# Altium project Solar_PowerBoard.PrjPcb
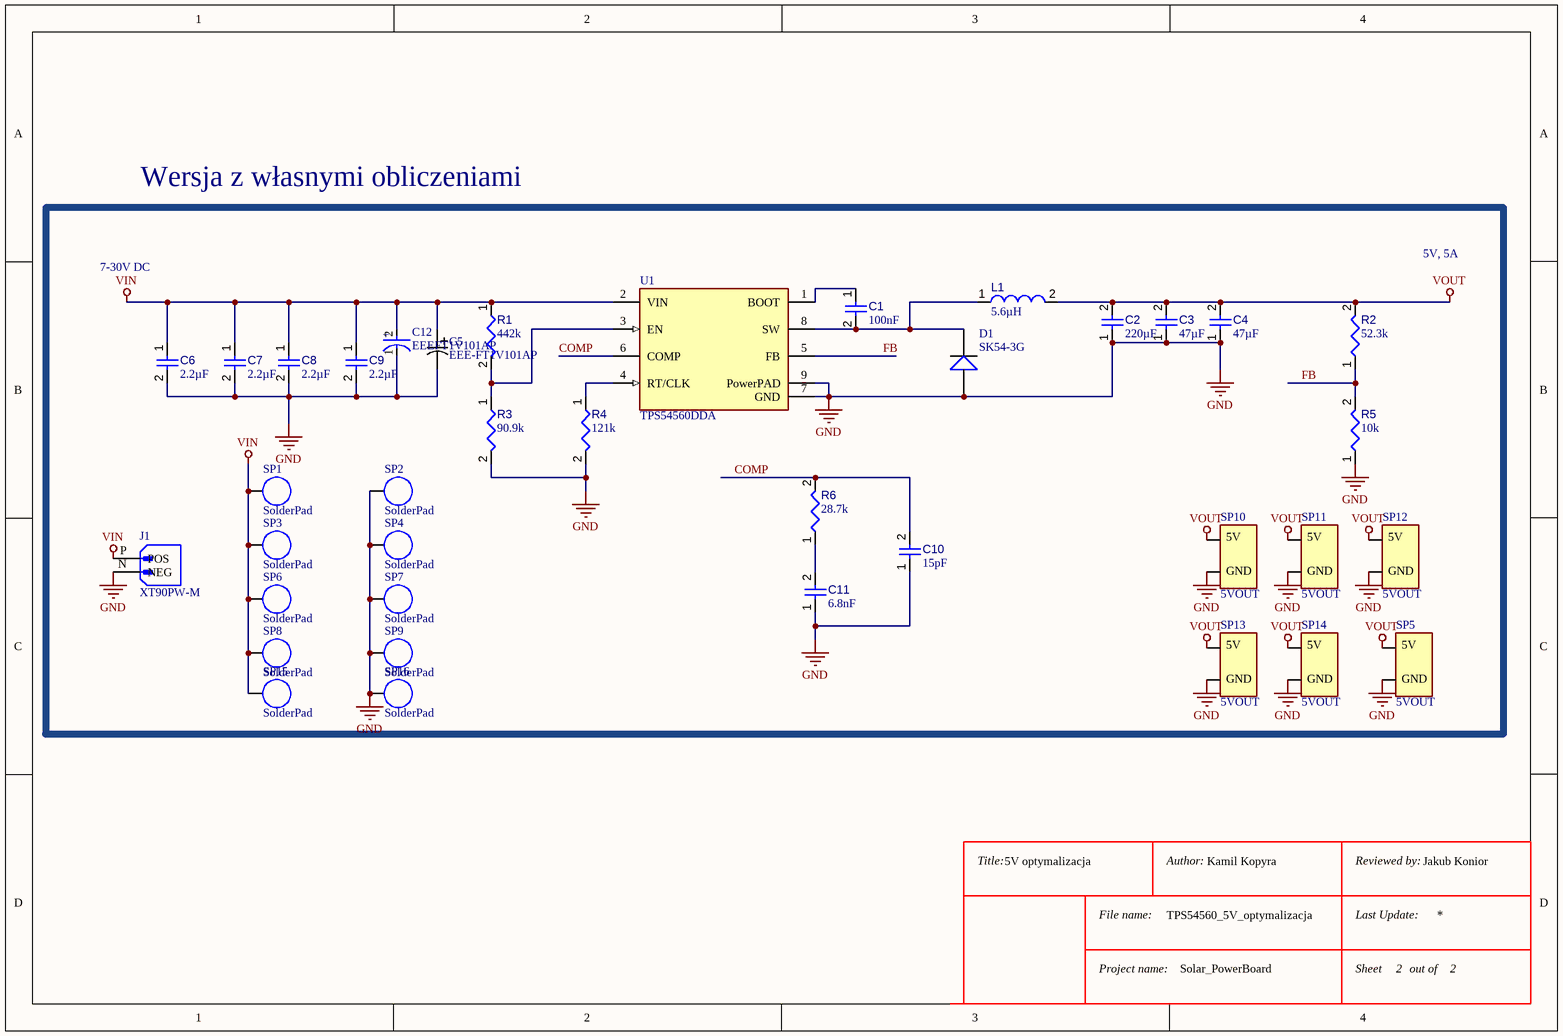
[diagram p0: TPS54560_5V_optymalizacja.SchDoc]
CAGE_CODE: ?????; CONTRACT_NUMBER: <CONTRACT NO>; DOC_NO_ASSY_DWG: <ASSY DWG NO>; DOC_NO_BOM: <BOM DOC NO>; DOC_NO_FAB_DWG: <FAB DWG NO>; DOC_NO_SCH_DWG: <SCH DWG NO>; PCB_2_DEC_TOL: +/-.01; PCB_3_DEC_TOL: +/-.010; PCB_ANG_TOL: +/-1/2; PCB_ASSEMBLY_NO: <PCB ASSY NO>; PCB_CHECKER: - -----; PCB_CHECKER_APP_DATE: --/--/----; PCB_DESIGNER: - -----; PCB_DESIGNER_APP_DATE: --/--/----; PCB_DWG_NO: <PCB DWG NO>; PCB_ENGINEER: - -----; PCB_ENGINEER_APP_DATE: --/--/----; PCB_PART_NUMBER: <PCB PN>; PCB_REV: A; SCH_REV: A
2 sheets, 38 parts. Net scope: global (net labels, ports and power ports of the same name join across sheets).
Board files: Solar_PowerBoard_JK.PcbDoc, Solar_PowerBoard_KK.PcbDoc, Panel.PcbDoc
Sheets:
  Main.SchDoc
  TPS54560_5V_optymalizacja.SchDoc

## Sheet Main.SchDoc
size A4; SheetNumber: 1; SheetTotal: 4; ENG_APP_DATE: --/--/--; DSN_APP_DATE: --/--/--; CHK_APP_DATE: --/--/--

### Notes on the sheet
- Title:
- File name:
- Author:
- Reviewed by:
- Last Update:
- Project name:
- Sheet
- out of

## Sheet TPS54560_5V_optymalizacja.SchDoc
size A4; SheetNumber: 2; SheetTotal: 2

### Parts
C1  value 100nF  [CAPC0805(2012)145_L]  (hidden comment: Capacitor 100nF +/-40% 6.3V 0805)
C2  value 220µF  [CAPC3216X180X50NL20T25]  (hidden comment: Capacitor 220 uF +/- 10% 16 V 1206)
C3  value 47µF  [CAPC0805(2012)145_L]  (hidden comment: Capacitor 47µF +/-40% 6.3V 0805)
C4  value 47µF  [CAPC0805(2012)145_L]  (hidden comment: Capacitor 47µF +/-40% 6.3V 0805)
C5  EEE-FT1V101AP  [CapBulk]
C6  value 2.2µF  [CAPC0805(2012)145_L]  (hidden comment: Capacitor 2.2µF +/-40% 35V 0805)
C7  value 2.2µF  [CAPC0805(2012)145_L]  (hidden comment: Capacitor 2.2µF +/-40% 35V 0805)
C8  value 2.2µF  [CAPC0805(2012)145_L]  (hidden comment: Capacitor 2.2µF +/-40% 35V 0805)
C9  value 2.2µF  [CAPC0805(2012)145_L]  (hidden comment: Capacitor 2.2µF +/-40% 35V 0805)
C10  value 15pF  [CAPC0402(1005)60_L]  (hidden comment: Capacitor 15pF +/-20% 10V 0402)
C11  value 6.8nF  [CAPC0402(1005)60_L]  (hidden comment: Capacitor 15pF +/-20% 10V 0402)
C12  EEEFT1V101AP  [FP-FTD-MFG]
D1  SK54-3G  [SK54-3G]
J1  XT90PW-M  [AMASS_XT90PW-M]
L1  value 5.6µH  [SUSUMU-PCMB063T_V]  (hidden comment: Inductor 5.6uH)
R1  value 442k  [RESC0805(2012)_L]  (hidden comment: Resistor 442kR +/-5% 0805 125 mW)
R2  value 52.3k  [RESC1005X40X25ML05T05]  (hidden comment: Resistor 52.3k +/-1% 0402 100 mW)
R3  value 90.9k  [RESC0805(2012)_L]  (hidden comment: Resistor 90.9 kOhms  +/-5 % 0805 125 mW)
R4  value 121k  [RESC0805(2012)_L]  (hidden comment: Resistor 121 kOhms  +/-5 % 0805 125 mW)
R5  value 10k  [RESC1005X40X25ML05T05]  (hidden comment: Resistor 10k +/-1% 0402 100 mW)
R6  value 28.7k  [RESC1005X40X25ML05T05]  (hidden comment: Resistor 28.7k +/-1% 0402 100 mW)
SP1  SolderPad  [SolderPad]
SP2  SolderPad  [SolderPad]
SP3  SolderPad  [SolderPad]
SP4  SolderPad  [SolderPad]
SP5  5VOUT  [5VOUT]
SP6  SolderPad  [SolderPad]
SP7  SolderPad  [SolderPad]
SP8  SolderPad  [SolderPad]
SP9  SolderPad  [SolderPad]
SP10  5VOUT  [5VOUT]
SP11  5VOUT  [5VOUT]
SP12  5VOUT  [5VOUT]
SP13  5VOUT  [5VOUT]
SP14  5VOUT  [5VOUT]
SP15  SolderPad  [SolderPad]
SP16  SolderPad  [SolderPad]
U1  TPS54560DDA  [FP-DDA0008E-MFG]

### Nets
GND: C2.1 C3.1 C4.1 C5.2 C6.2 C7.2 C8.2 C9.2 C10.1 C11.1 C12.1(C) D1.1 J1.N(NEG) R3.2 R4.2 R5.1 SP2.1 SP4.1 SP5.2 SP7.1 SP9.1 SP10.2 SP11.2 SP12.2 SP13.2 SP14.2 SP16.1 U1.7(GND) U1.9(PowerPAD)
VIN: C5.1 C6.1 C7.1 C8.1 C9.1 C12.2(A) J1.P(POS) R1.1 SP1.1 SP3.1 SP6.1 SP8.1 SP15.1 U1.2(VIN)
VOUT: C2.2 C3.2 C4.2 L1.2 R2.2 SP5.1 SP10.1 SP11.1 SP12.1 SP13.1 SP14.1
COMP: C10.2 R6.2 U1.6(COMP)
FB: R2.1 R5.2 U1.5(FB)
NetC1_1: C1.1 U1.1(BOOT)
NetC1_2: C1.2 D1.2 L1.1 U1.8(SW)
NetC11_2: C11.2 R6.1
NetR1_2: R1.2 R3.1 U1.3(EN)
NetR4_1: R4.1 U1.4(RT/CLK)

### Notes on the sheet
- Wersja z własnymi obliczeniami
- 7-30V DC
- 5V, 5A
- 5V optymalizacja
- TPS54560_5V_optymalizacja
- Kamil Kopyra
- Jakub Konior
- Solar_PowerBoard
- Title:
- File name:
- Author:
- Reviewed by:
- Last Update:
- Project name:
- Sheet
- out of
- (in symbol 5VOUT) 5V; GND
- (in symbol CMP-05427-000027-1) +

### Library data of the parts
C1 = CMP-001-00085-1: Chip Capacitor, 100nF +/-40%, 6.3V, 0805, Thickness 1.45 mm; Tolerance: 10%; Case/Package: 0805; Max Operating Temperature: 85°C; Mounting Technology: SMT; Min Operating Temperature: -55°C; Voltage Rating: 6.3V; Pins: 2
C2 = CMP-001-00088-1: Chip Capacitor, 220 uF, +/- 10%, 16 V, 1206 (3216 Metric); Capacitor Type: Ceramic; Voltage Rating: 16V; RoHS Compliant: True; Mounting Technology: SM; Tolerance: 10%; Max Operating Temperature: 125°C; Case/Package: 1206; Pins: 2; Min Operating Temperature: -55°C
C3 C4 = CMP-001-00082-4: Chip Capacitor, 47µF +/-40%, 6.3V, 0805, Thickness 1.45 mm; Tolerance: 10%; Min Operating Temperature: -55°C; Max Operating Temperature: 85°C; Case/Package: 0805; Pins: 2; Mounting Technology: SMT; Voltage Rating: 6.3V
C5 = EEE-FT1V101AP: Description; Manufacturer_Name: Panasonic; Copyright: Copyright (C) 2025 Ultra Librarian. All rights reserved.; Manufacturer_Part_Number: EEE-FT1V101AP
C6-C9 = CMP-001-00089-1: Chip Capacitor, 2.2µF +/-40%, 35V, 0805, Thickness 1.45 mm; Tolerance: 20%; Pins: 2; Max Operating Temperature: 85°C; Mounting Technology: SMT; Voltage Rating: 35V; Min Operating Temperature: -55°C; Case/Package: 0805
C10 C11 = CMP-001-00087-1: Chip Capacitor, 15pF +/-20%, 10V, 0402, Thickness 0.6 mm; Tolerance: 20%; Voltage Rating: 10V; Min Operating Temperature: -55°C; Mounting Technology: SMT; Pins: 2; Max Operating Temperature: 85°C; Case/Package: 0402
C12 = CMP-05427-000027-1: CAP ALUM 100UF 20% 35V SMD; Ripple Current: 300mA; Polarity: Polar; Life (Hours): 2000Hour; Lead Diameter: 0.65mm; ESR (Equivalent Series Resistance): 260mR; Leakage Current: 35uA; REACH SVHC: No SVHC; Series: FT; Min Operating Temperature: -55°C; Diameter: 6.3mm; Max Operating Temperature: 105°C; Number of Pins: 2; Package Quantity: 1000; Length: 5.8mm; Lead Pitch: 1.8mm; Voltage: 35V; Construction: Cylindrical; Capacitance: 100uF; Height: 5.8mm; Tolerance: 20%; RoHS Compliant: Yes; Packaging: Tape and Reel; Ripple Current (AC): 300mA; Height - Seated (Max): 0.24inch; Voltage Rating: 35V; Radiation Hardening: No; Contact Plating: Tin; Termination: SMD/SMT; Voltage Rating (DC): 35V; Case/Package: Radial; Mount: Surface Mount
D1 = Diode
J1 = CMP-002-00071-1: Socket; DC supply; XT90; male; PIN: 2; on PCBs; THT; Colour: yellow; MF: AMASS; Check_prices: https://www.snapeda.com/parts/XT90PW-M/AMASS/view-part/?ref=eda; Pins: 2; Case/Package: Package; SnapEDA_Link: https://www.snapeda.com/parts/XT90PW-M/AMASS/view-part/?ref=snap; Design Item ID: XT90PW-M; Component Type: Standard; Source: XT90PW-M.SchLib; Value: *; MP: XT90PW-M
L1 = CMP-006-00023-1: Shielded Wirewound Inductor, 5.6 uH, +/- 20%, -20 to 120 degC, 2-Pin SMD, RoHS, Tape and Reel; Pins: 2; Tolerance: 20%; Case/Package: SMD/SMT
R1 = CMP-009-00178-1: Chip Resistor, 442 kOhms, +/-5%, 125 mW, -55 to 155 degC, 0805; Tolerance: 5%; Power: 125mW; Min Operating Temperature: -55°C; Case/Package: 0805; Pins: 2; Max Operating Temperature: 155°C
R2 = CMP-009-00183-2: Chip Resistor, 52.3 KOhm, +/- 1%, 0.1 W, -55 to 155 degC, 0402 (1005 Metric); Voltage Rating: 50V; Power: 100mW; Max Operating Temperature: 155°C; Tolerance: 1%; Min Operating Temperature: -55°C; Pins: 2; Case/Package: 0402; Mounting Technology: SM; RoHS Compliant: True
R3 = CMP-009-00180-1: Chip Resistor, 90.9 kOhms, +/-5 %, 125 mW, -55 to 155 degC, 0805; Tolerance: 5%; Power: 125mW; Case/Package: 0805; Pins: 2; Min Operating Temperature: -55°C; Max Operating Temperature: 155°C
R4 = CMP-009-00184-1: Chip Resistor, 121 kOhms, +/-5 %, 125 mW, -55 to 155 degC, 0805; Power: 125mW; Tolerance: 5%; Case/Package: 0805; Max Operating Temperature: 155°C; Min Operating Temperature: -55°C; Pins: 2
R5 = CMP-009-00015-5: Chip Resistor, 10 KOhm, +/- 1%, 0.1 W, -55 to 155 degC, 0402 (1005 Metric); Voltage Rating: 50V; Power: 100mW; Case/Package: 0402; RoHS Compliant: True; Min Operating Temperature: -55°C; Mounting Technology: SM; Tolerance: 1%; Max Operating Temperature: 155°C; Pins: 2
R6 = CMP-009-00182-1: Chip Resistor, 28.7 KOhm, +/- 1%, 0.1 W, -55 to 155 degC, 0402 (1005 Metric); Voltage Rating: 50V; Power: 100mW; Min Operating Temperature: -55°C; Case/Package: 0402; RoHS Compliant: True; Mounting Technology: SM; Pins: 2; Max Operating Temperature: 155°C; Tolerance: 1%
U1 = CMP-04918-000033-1: IC REG BCK SPLIT RAIL ADJ 8SOPWR; Manufacturer: Texas Instruments; Min Supply Voltage: 4.5V; Switching Topology: Buck; Max Junction Temp: +150°C; Max Duty Cycle: 100%; Standoff Height: 0mm; Output Type: AdjustableProgrammable; Output Voltage: 0.8-58.8V; Output Current: 5A; Number Of Outputs: 1; Switching Frequency: 100-2500kHz; Max Supply Voltage: 60V; Nominal Supply Current: 146uA; Octopart: https://octopart.com/tps54560dda-texas+instruments-26977150; Temperature: -40°C to +125°C; ComponentLink2Description: Datasheet; Category: IC; Mouser Description: Voltage Regulators - Switching Regulators 60V Input 5 A SD DC-DC Cnvtr; Automotive: No; Ipc Land Pattern Name: SOIC127P600X170-8; Height: 1.7mm; RoHS: TRUE; ComponentLink2URL: http://www.ti.com/lit/ds/symlink/tps54560.pdf; Device Class L3: Voltage Regulators - Switching; Temperature Range High: +125°C; Device Class L2: Power Management ICs; Package: DDA0008E; Lead Free: Yes; Digikey Description: IC REG BCK SPLIT RAIL ADJ 8SOPWR; Device Class L1: Integrated Circuits (ICs); Manufacturer Part Number: TPS54560DDA; Temperature Range Low: -40°C
SP1-SP4 SP6-SP9 SP15 SP16 = SolderPad: Value: *; HelpURL: *; MPN: *; classname: *
SP5 SP10-SP14 = 5VOUT: Value: *; HelpURL: *; MPN: *; classname: *

## Assembly variants
5V: all parts fitted